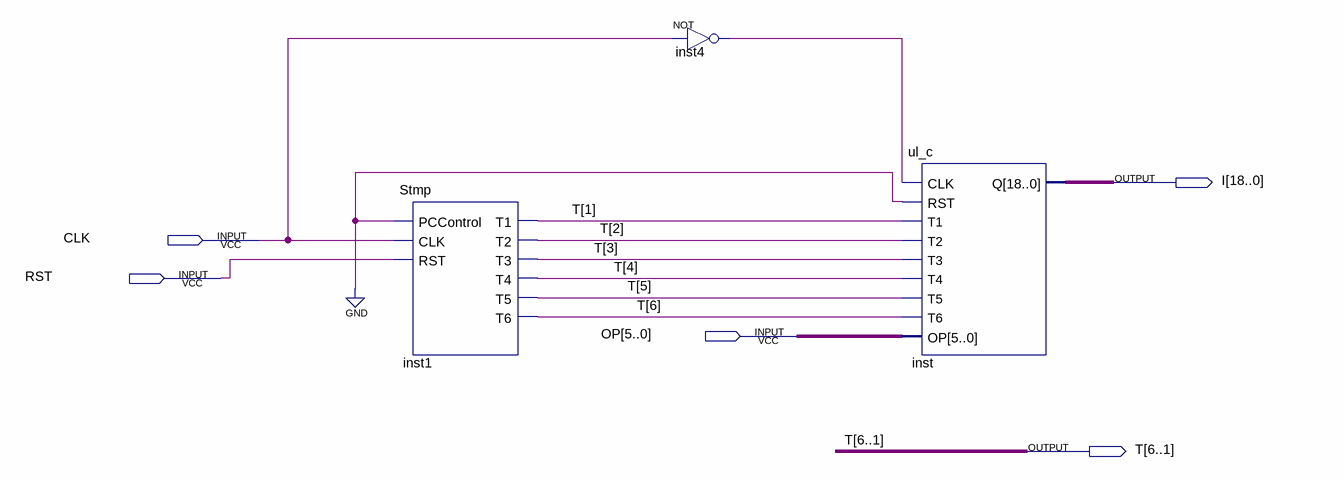
[diagram p0: schematic sheet]
// Quartus schematic test.bdf as structural Verilog: 3 symbols, 5 pins
module test (
  input  CLK,
  input  RST,
  input  [5:0] OP,
  output [18:0] I,
  output [6:1] T
);

  wire inst4_out;

  Stmp inst1 (.PCControl(1'b0), .CLK(CLK), .RST(RST), .T1(T[1]), .T2(T[2]), .T3(T[3]), .T4(T[4]), .T5(T[5]), .T6(T[6]));
  not inst4 (inst4_out, CLK);
  ul_c inst (
    .CLK(inst4_out), .RST(1'b0), .T1(T[1]), .T2(T[2]), .T3(T[3]), .T4(T[4]), .T5(T[5]), .T6(T[6]), .OP(OP),
    .Q(I));
endmodule
